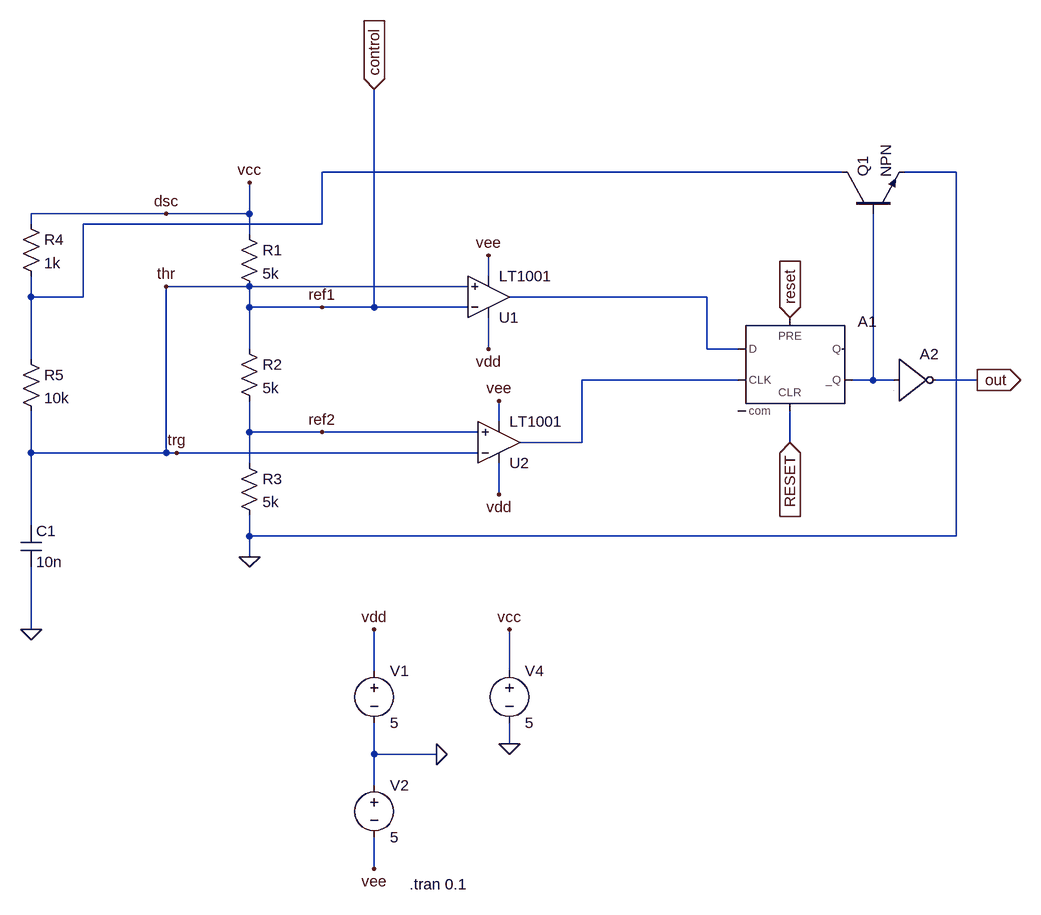
[diagram p0: schematic ne555 fail.asc]
ne555 fail.asc, the LTspice schematic file:
Version 4
SHEET 1 1536 980
WIRE 1232 -176 432 -176
WIRE 1408 -176 1328 -176
WIRE 192 -112 -16 -112
WIRE 320 -112 320 -160
WIRE 320 -112 192 -112
WIRE -16 -96 -16 -112
WIRE 432 -96 432 -176
WIRE 432 -96 64 -96
WIRE 320 -80 320 -112
WIRE 688 -16 688 -48
WIRE 320 0 192 0
WIRE 656 0 320 0
WIRE -16 16 -16 -16
WIRE 64 16 64 -96
WIRE 64 16 -16 16
WIRE 1024 16 720 16
WIRE 320 32 320 0
WIRE 432 32 320 32
WIRE 512 32 512 -304
WIRE 512 32 432 32
WIRE 656 32 512 32
WIRE 320 96 320 32
WIRE 688 96 688 48
WIRE 1024 96 1024 16
WIRE 1072 96 1024 96
WIRE -16 112 -16 16
WIRE 1072 144 832 144
WIRE 1280 144 1280 -112
WIRE 1280 144 1248 144
WIRE 1312 144 1280 144
WIRE 1440 144 1376 144
WIRE 704 208 704 176
WIRE 320 224 320 176
WIRE 432 224 320 224
WIRE 672 224 432 224
WIRE 832 240 832 144
WIRE 832 240 736 240
WIRE 1152 240 1152 192
WIRE -16 256 -16 192
WIRE 192 256 192 0
WIRE 192 256 -16 256
WIRE 208 256 192 256
WIRE 672 256 208 256
WIRE 320 272 320 224
WIRE 704 320 704 272
WIRE -16 368 -16 256
WIRE 320 384 320 352
WIRE 1408 384 1408 -176
WIRE 1408 384 320 384
WIRE 320 416 320 384
WIRE -16 528 -16 432
WIRE 512 592 512 528
WIRE 720 592 720 528
WIRE 720 704 720 672
WIRE 512 720 512 672
WIRE 608 720 512 720
WIRE 512 768 512 720
WIRE 512 896 512 848
FLAG 512 528 vdd
FLAG 320 416 0
FLAG 320 -160 vcc
FLAG 512 896 vee
FLAG 688 -48 vee
FLAG 704 176 vee
FLAG 704 320 vdd
FLAG 688 96 vdd
FLAG 608 720 0
FLAG 720 704 0
FLAG 720 528 vcc
FLAG 432 32 ref1
FLAG 432 224 ref2
FLAG 208 256 trg
FLAG 192 0 thr
FLAG 192 -112 dsc
FLAG -16 528 0
FLAG 1152 240 RESET
IOPIN 1152 240 In
FLAG 1440 144 out
IOPIN 1440 144 Out
FLAG 1152 48 reset
IOPIN 1152 48 In
FLAG 512 -304 control
IOPIN 512 -304 In
SYMBOL voltage 512 576 R0
WINDOW 123 0 0 Left 0
WINDOW 39 0 0 Left 0
SYMATTR InstName V1
SYMATTR Value 5
SYMBOL res 304 -96 R0
SYMATTR InstName R1
SYMATTR Value 5k
SYMBOL res 304 80 R0
SYMATTR InstName R2
SYMATTR Value 5k
SYMBOL res 304 256 R0
SYMATTR InstName R3
SYMATTR Value 5k
SYMBOL OpAmps\\LT1001 688 80 M180
SYMATTR InstName U1
SYMBOL OpAmps\\LT1001 704 304 M180
SYMATTR InstName U2
SYMBOL voltage 512 752 R0
WINDOW 123 0 0 Left 0
WINDOW 39 0 0 Left 0
SYMATTR InstName V2
SYMATTR Value 5
SYMBOL voltage 720 576 R0
WINDOW 123 0 0 Left 0
WINDOW 39 0 0 Left 0
SYMATTR InstName V4
SYMATTR Value 5
SYMBOL res -32 -112 R0
SYMATTR InstName R4
SYMATTR Value 1k
SYMBOL res -32 96 R0
SYMATTR InstName R5
SYMATTR Value 10k
SYMBOL cap -32 368 R0
SYMATTR InstName C1
SYMATTR Value 10n
SYMBOL Digital\\dflop 1152 48 R0
SYMATTR InstName A1
SYMBOL Digital\\inv 1312 80 R0
SYMATTR InstName A2
SYMBOL npn 1232 -112 R270
SYMATTR InstName Q1
TEXT 566 920 Left 2 !.tran 0.1

The netlist it stands for:
* ne555 fail.asc
V1 vdd 0 5
R1 dsc control 5k
R2 control ref2 5k
R3 ref2 0 5k
XU1 control control vdd vee N002 LT1001  ; pins In+ In- V+ V- OUT
XU2 ref2 control vdd vee N003 LT1001  ; pins In+ In- V+ V- OUT
V2 0 vee 5
V4 dsc 0 5
R4 dsc N001 1k
R5 N001 control 10k
C1 control 0 10n
A1 N002 0 N003 RESET RESET N004 0 0 DFLOP
A2 N004 0 0 0 0 out 0 0 BUF
Q1 N001 N004 0 0 NPN
.model NPN NPN
.model PNP PNP
.lib standard.bjt
.tran 0.1
.lib LTC.lib
.backanno
.end